# EAGLE schematic manyMelody (EAGLE 8.7.0)
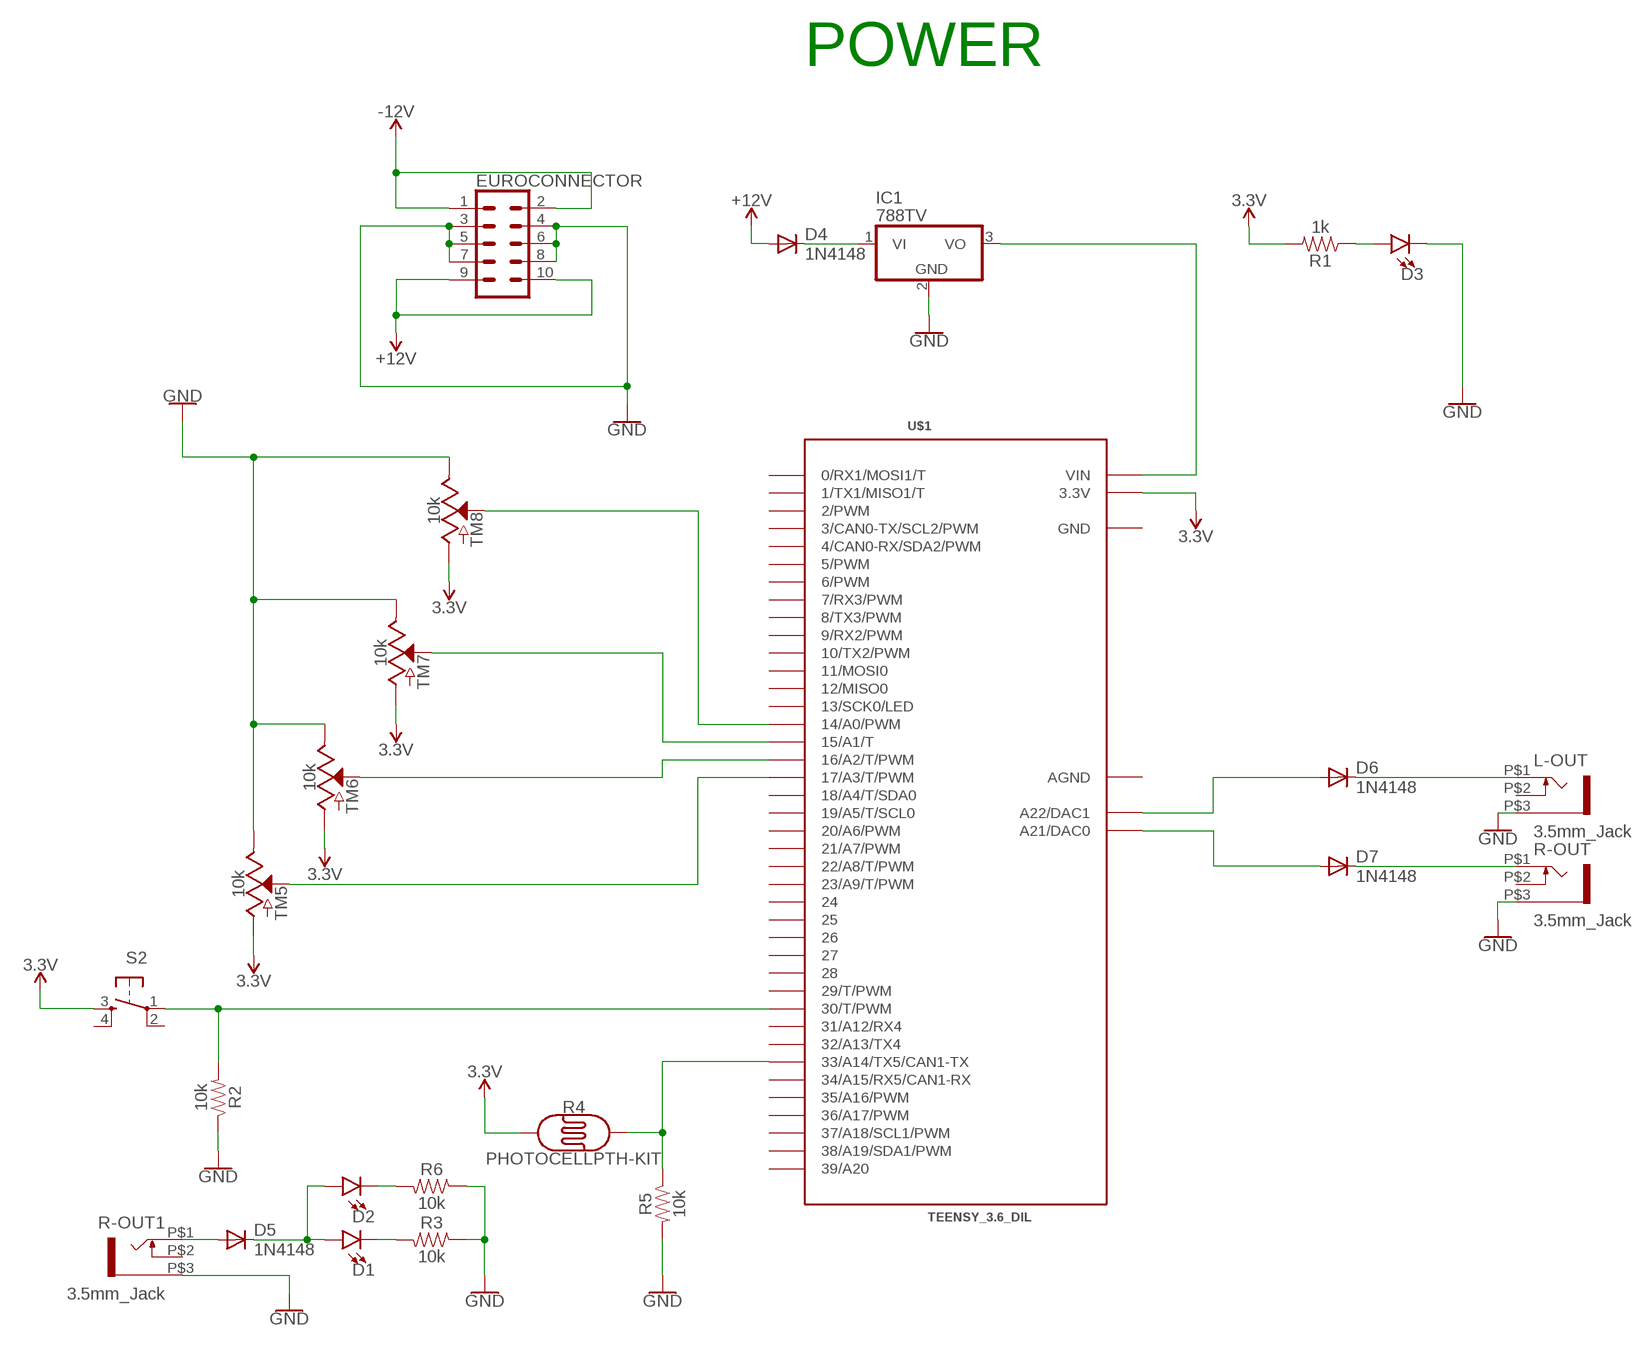
[diagram p0: schematic, sheet 1]

## Parts
D1  LED-3MM-NO_SILK  [LED_3MM-NS]
D2  LED-3MM-NO_SILK  [LED_3MM-NS]
D3  LED-3MM-NO_SILK  [LED_3MM-NS]
D4  1N4148  1N4004  [DO41-10]
D5  1N4148  1N4004  [DO41-10]
D6  1N4148  1N4004  [DO41-10]
D7  1N4148  1N4004  [DO41-10]
EUROCONNECTOR  CONN_05X2SHD  [2X5-SHROUDED]
IC1  788TV  [TO220V]
L-OUT  3.5mm_Jack  WQP-PJ301M-12_JACK  [WQP-PJ301M-12_JACK]
R1  1k  1KOHM-HORIZ-1/4W-5%  [AXIAL-0.3]
R2  10k  1KOHM-HORIZ-1/4W-5%  [AXIAL-0.3]
R3  10k  1KOHM-HORIZ-1/4W-5%  [AXIAL-0.3]
R4  PHOTOCELLPTH-KIT  [PHOTOCELL-KIT]
R5  10k  1KOHM-HORIZ-1/4W-5%  [AXIAL-0.3]
R6  10k  1KOHM-HORIZ-1/4W-5%  [AXIAL-0.3]
R-OUT  3.5mm_Jack  WQP-PJ301M-12_JACK  [WQP-PJ301M-12_JACK]
R-OUT1  3.5mm_Jack  WQP-PJ301M-12_JACK  [WQP-PJ301M-12_JACK]
S2  TAC_SWITCHPTH  [TACTILE-PTH]
TM5  10k  POTENTIOMETER-PTH-9MM-1/20W-20%  [POT-PTH-ALPS]
TM6  10k  POTENTIOMETER-PTH-9MM-1/20W-20%  [POT-PTH-ALPS]
TM7  10k  POTENTIOMETER-PTH-9MM-1/20W-20%  [POT-PTH-ALPS]
TM8  10k  POTENTIOMETER-PTH-9MM-1/20W-20%  [POT-PTH-ALPS]
U$1  TEENSY_3.6_DIL  [TEENSY_3.6_DIL]

## Nets
3.3V: R1.P$2 R4.1 S2.3 TM5.P$3(A) TM6.P$3(A) TM7.P$3(A) TM8.P$3(A) U$1.3.3V U$1.3.3V3(3.3V)
5V: IC1.3(VO) U$1.VIN
+12V: D4.A EUROCONNECTOR.9 EUROCONNECTOR.10
-12V: EUROCONNECTOR.1 EUROCONNECTOR.2
GND: D3.K(C) EUROCONNECTOR.3 EUROCONNECTOR.4 EUROCONNECTOR.5 EUROCONNECTOR.6 EUROCONNECTOR.7 EUROCONNECTOR.8 IC1.2(GND) L-OUT.P$3 R2.P$1 R3.P$1 R5.P$2 R6.P$1 R-OUT1.P$3 R-OUT.P$3 TM5.P$1(E) TM6.P$1(E) TM7.P$1(E) TM8.P$1(E)
N$1: D1.A D2.A D5.C
N$2: D1.K(C) R3.P$2
N$3: R2.P$2 S2.1 U$1.30(30/T/PWM)
N$4: R4.2 R5.P$1 U$1.33/A14(33/A14/TX5/CAN1-TX)
N$5: D2.K(C) R6.P$2
N$6: D3.A R1.P$1
N$7: D6.C L-OUT.P$1
N$8: D7.C R-OUT.P$1
N$9: D6.A U$1.A22(A22/DAC1)
N$10: D7.A U$1.A21(A21/DAC0)
N$11: TM8.P$2(S) U$1.14/A0(14/A0/PWM)
N$12: TM7.P$2(S) U$1.15/A1(15/A1/T)
N$13: TM6.P$2(S) U$1.16/A2(16/A2/T/PWM)
N$14: TM5.P$2(S) U$1.17/A3(17/A3/T/PWM)
N$15: D4.C IC1.1(VI)
N$16: D5.A R-OUT1.P$1
Unconnected: L-OUT.P$2 R-OUT1.P$2 R-OUT.P$2 S2.2 S2.4 U$1.0(0/RX1/MOSI1/T) U$1.1(1/TX1/MISO1/T) U$1.2(2/PWM) U$1.3(3/CAN0-TX/SCL2/PWM) U$1.4(4/CAN0-RX/SDA2/PWM) U$1.5(5/PWM) U$1.6(6/PWM) U$1.7(7/RX3/PWM) U$1.8(8/TX3/PWM) U$1.9(9/RX2/PWM) U$1.10(10/TX2/PWM) U$1.11(11/MOSI0) U$1.12(12/MISO0) U$1.13(13/SCK0/LED) U$1.18/A4(18/A4/T/SDA0) U$1.19/A5(19/A5/T/SCL0) U$1.20/A6(20/A6/PWM) U$1.21/A7(21/A7/PWM) U$1.22/A8(22/A8/T/PWM) U$1.23/A9(23/A9/T/PWM) U$1.24 U$1.25 U$1.26 U$1.27 U$1.28 U$1.29(29/T/PWM) U$1.31/A12(31/A12/RX4) U$1.32/A13(32/A13/TX4) U$1.34/A15(34/A15/RX5/CAN1-RX) U$1.35/A16(35/A16/PWM) U$1.36/A17(36/A17/PWM) U$1.37/A18(37/A18/SCL1/PWM) U$1.38/A19(38/A19/SDA1/PWM) U$1.39/A20

## Notes on the sheet
- POWER

## Power pins joined to a net without a drawn wire
AGND: U$1.AGND
GND: U$1.GND U$1.GND1(GND)

## Library data of the parts
D1-D3 = SparkFun-LED:LED: LED (Generic) Standard schematic elements and footprints for 5mm, 3mm, 1206, and 0603 sized LEDs. Generic LEDs with no color specified.
D4-D7 = diode:1N4004: DIODE general purpose rectifier, 1 A
EUROCONNECTOR = SparkFun-Connectors:CONN_05X2: Multi connection point. Often used as Generic Header-pin footprint for 0.1 inch spaced/style header connections For AVR SPI programming port, see special device with nice symbol: "AVR_SPI_PROG_5x2.dev" You can populate with any combo of single row headers, but if you'd like an exact match, check these: 2x5 AVR ICSP Male Header <https://www.sparkfun.com/products/778> (PRT-00778) 2x5 Pin Shrouded Header <https://www.sparkfun.com/products/8506> (PRT-08506) On any of the 0.1 inch spaced packages, you can populate with these: Break Away Headers - Straight <https://www.sparkfun.com/products/116> (PRT-00116) Break Away Male Headers - Right Angle <https://www.sparkfun.com/products/553> (PRT-00553) Female Headers <https://www.sparkfun.com/products/115> (PRT-00115) Break Away Headers - Machine Pin <https://www.sparkfun.com/products/117> (PRT-00117) Break Away Female Headers - Swiss Machine Pin <https://www.sparkfun.com/products/743> (PRT-00743) Special note: the shrouded connector mates well with our 5x2 ribbon cables: 2x5 Pin IDC Ribbon Cable <https://www.sparkfun.com/products/8535> (PRT-08535); PROD_ID: CONN-08671; SF_ID: PRT-08506
IC1 = linear:78*: Positive VOLTAGE REGULATOR Source: http://cache.national.com/ds/LM/LM78L05.pdf http://www.fairchildsemi.com/ds/LM/LM7805.pdf
L-OUT R-OUT R-OUT1 = thonkiconn:WQP-PJ301M-12_JACK
R1 = SparkFun-Resistors:1KOHM: 1kΩ resistor A resistor is a passive two-terminal electrical component that implements electrical resistance as a circuit element. Resistors act to reduce current flow, and, at the same time, act to lower voltage levels within circuits. - Wikipedia; PROD_ID: RES-08380
R2 R3 R5 R6 = SparkFun-Resistors:1KOHM: 1kΩ resistor A resistor is a passive two-terminal electrical component that implements electrical resistance as a circuit element. Resistors act to reduce current flow, and, at the same time, act to lower voltage levels within circuits. - Wikipedia; PROD_ID: RES-08380; VALUE: 1k
R4 = SparkFun-Sensors:PHOTOCELL: Photocell (Photodetector, Photo Resistor, CdS) This is a very small light sensor. A photocell changes (also called a photodetector, photo resistor, CdS or photoconductive cell) resistance depending on the amount of light it is exposed to. These little sensors make great ambient light triggers (when light in the room turns on, do something). Datasheet <http://cdn.sparkfun.com/datasheets/Sensors/LightImaging/SEN-09088.pdf> SparkFun Products Mini Photocell <https://www.sparkfun.com/products/9088> (SEN-09088); PROD_ID: COMP-09129; SF_ID: SEN-09088
S2 = SparkFun-Retired:TAC_SWITCH: Momentary Switch Button commonly used for reset or general input. Spark Fun Electronics SKU : COM-00097 SMT- SWCH-08247
TM5-TM8 = SparkFun-Resistors:POTENTIOMETER: Potentiometer (Pot) Three-terminal potentiometers, with an adjustable wiper and two adjustable resistors. A pot can be used to create a configurable voltage divider, or as a variable resistor. Variants ALPS_POT and ALPS_POT_KIT - PTH, breadboard compatible, 9mm square pots Rotary Potentiometer - Linear (10k ohm) <https://www.sparkfun.com/products/9288> (COM-09288) The KIT variant exposes copper on only one side of the PTH pad, so the part can only be assembled on one side of the PCB. Useful for beginner soldering kits.; PROD_ID: RES-09177; SF_SKU: COM-09288
U$1 = Teensy_3_and_LC_Series_Boards_v1.4:TEENSY_3.6_DIL: Teensy 3.6 DIL Package